# Altium schematic sheet Measurment ICs.SchDoc: Sensors - RC Car
size A3; DrawnBy: Grzegorz Jabłoński; Revision: V1.3; SheetNumber: 3; SheetTotal: 3
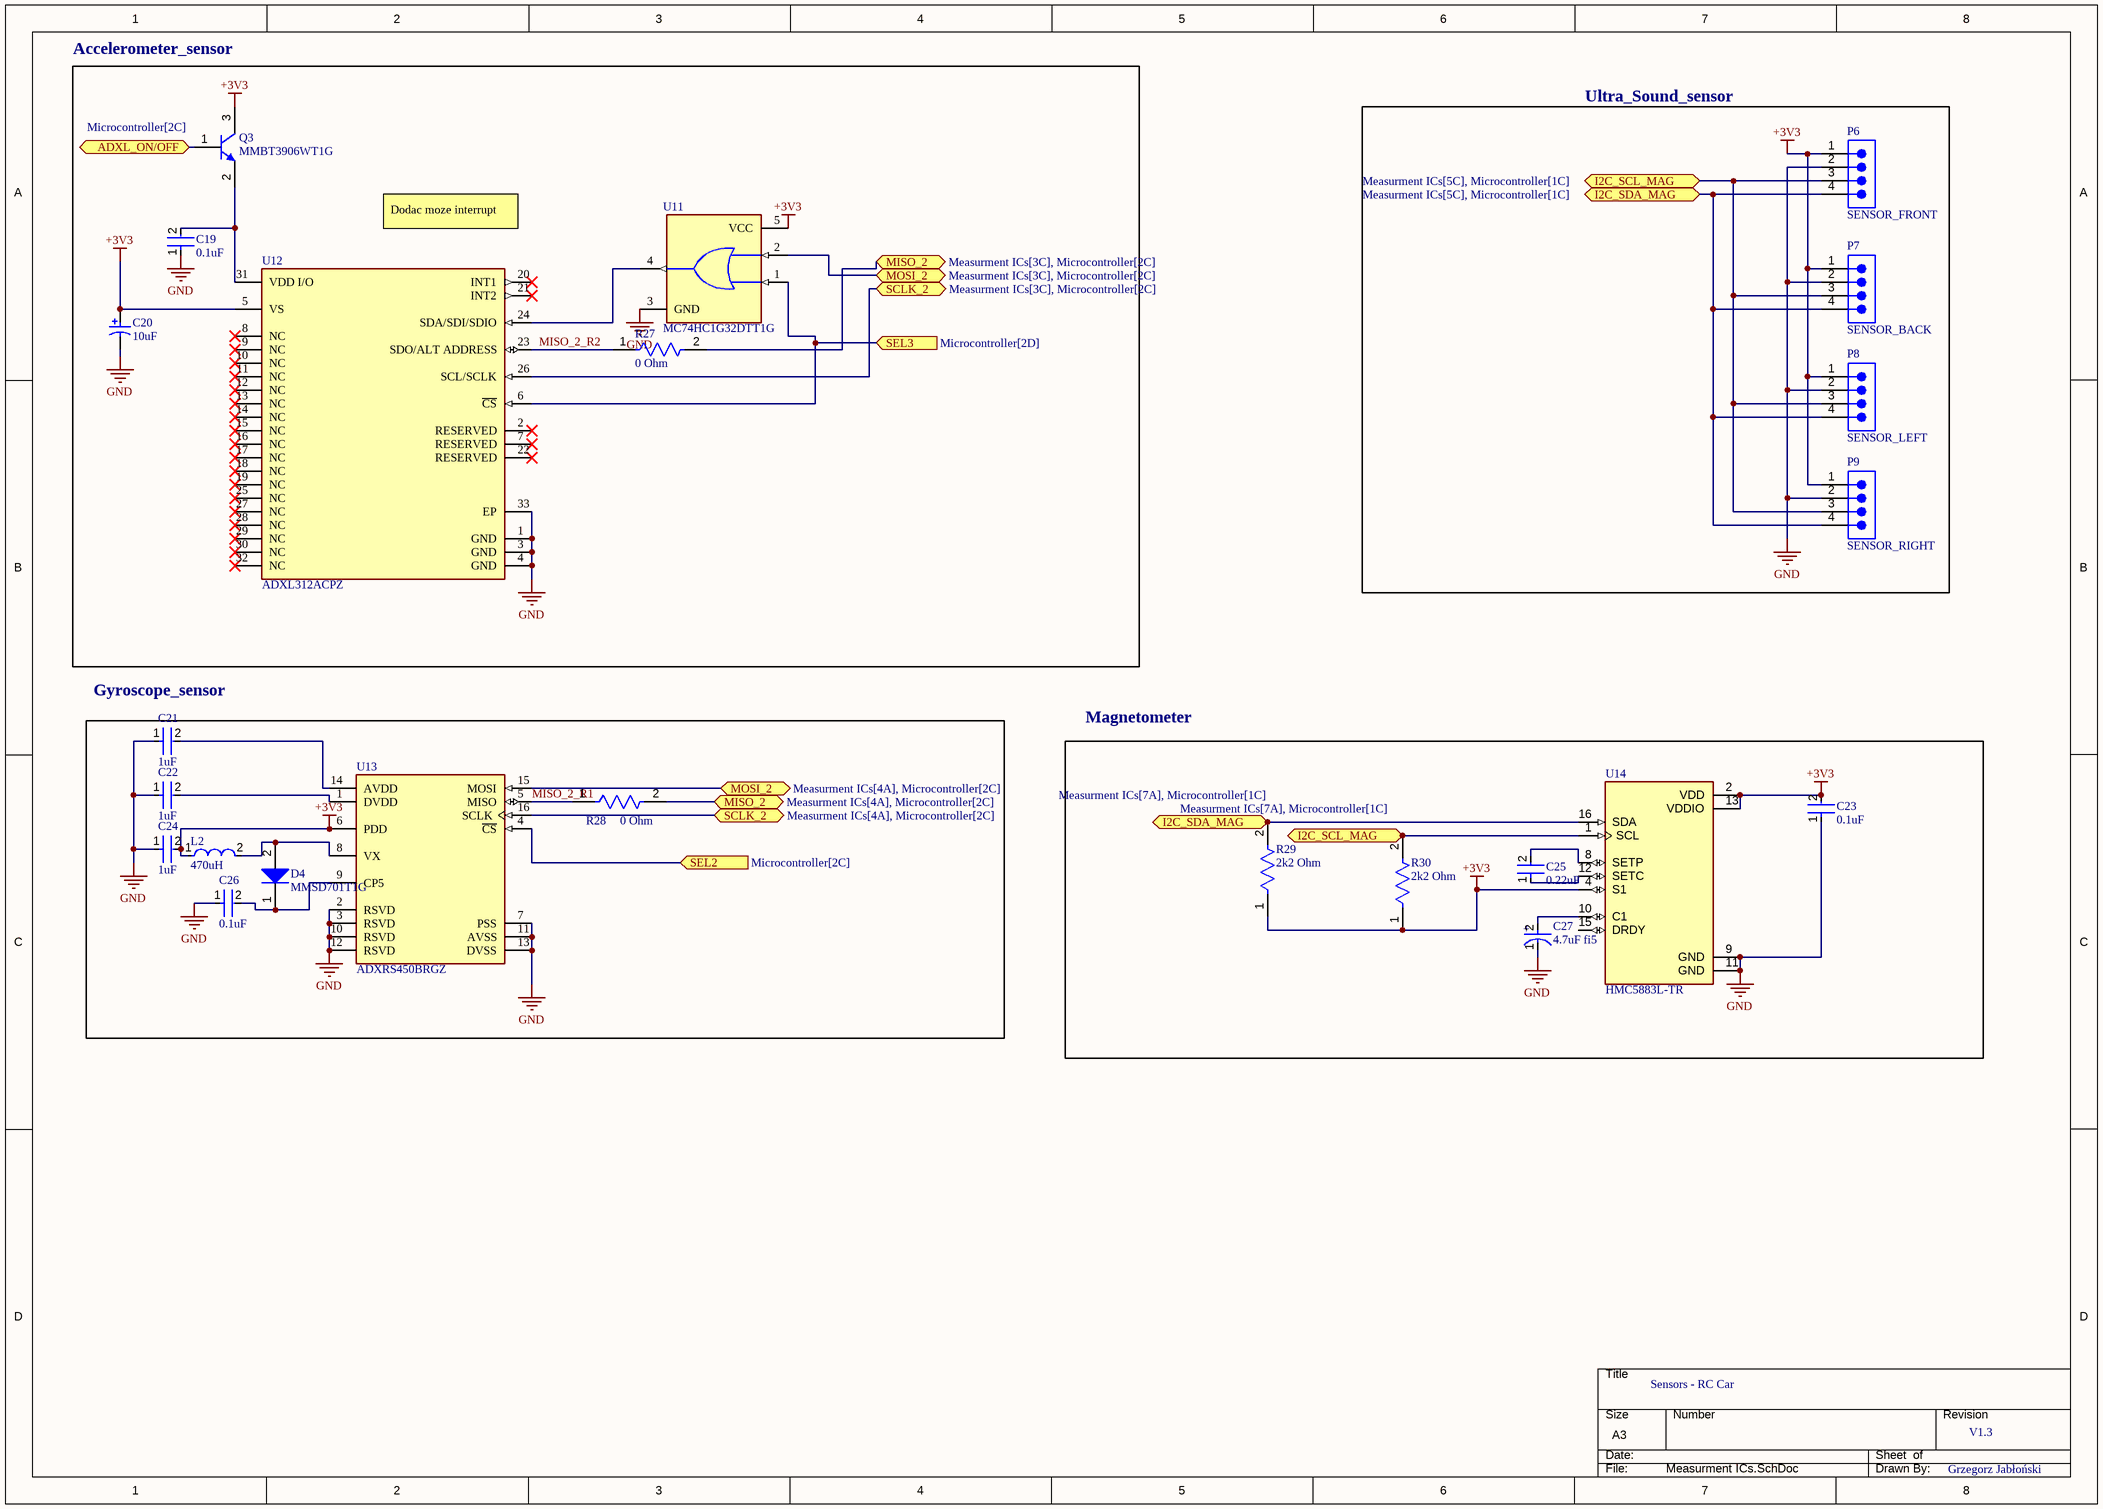
[diagram p0: Measurment ICs.SchDoc]

## Parts
C19  0.1uF  [FP-CC0805-0_85-MFG]
C20  10uF  [KEMT-A-3216-18-2_M]
C21  1uF  [FP-CC0805-0_85-MFG]
C22  1uF  [FP-CC0805-0_85-MFG]
C23  0.1uF  [FP-CC0805-0_85-MFG]
C24  1uF  [FP-CC0805-0_85-MFG]
C25  0.22uF  [FP-CC0805-0_85-MFG]
C26  0.1uF  [FP-CC0805-0_85-MFG]
C27  4.7uF fi5  [FP-RAD-TH-D_5_0_5-L_11_1-MFG]
D4  MMSD701T1G  [ONSC-SOD-123-2-425-04_V]
L2  470uH  [FP-LQH43CN_03-MFG]
P6  SENSOR_FRONT  [61300411121]
P7  SENSOR_BACK  [61300411121]
P8  SENSOR_LEFT  [61300411121]
P9  SENSOR_RIGHT  [61300411121]
Q3  MMBT3906WT1G  [ONSC-SC-70-3-419-04_V]
R27  0 Ohm  [FP-RMCF0805-MFG]
R28  0 Ohm  [FP-RMCF0805-MFG]
R29  2k2 Ohm  [FP-RMCF0805-MFG]
R30  2k2 Ohm  [FP-RMCF0805-MFG]
U11  MC74HC1G32DTT1G  [FP-483-MFG]
U12  ADXL312ACPZ  [FP-CP-32-17-MFG]
U13  ADXRS450BRGZ  [FP-RG-16-1-IPC_C]
U14  HMC5883L-TR  [XDCR_HMC5883L-TR]

## Blocks framed on the sheet
Ultra_Sound_sensor: P6-P9
Magnetometer: C23 C25 C27 R29 R30 U14

## Ports
ADXL_ON/OFF (bidir, see Microcontroller[2C]), I2C_SCL_MAG (bidir, see Measurment ICs[5C], Microcontroller[1C]), I2C_SCL_MAG (bidir, see Measurment ICs[7A], Microcontroller[1C]), I2C_SDA_MAG (bidir, see Measurment ICs[5C], Microcontroller[1C]), I2C_SDA_MAG (bidir, see Measurment ICs[7A], Microcontroller[1C]), MISO_2 (bidir, see Measurment ICs[3C], Microcontroller[2C]), MISO_2 (bidir, see Measurment ICs[4A], Microcontroller[2C]), MOSI_2 (bidir, see Measurment ICs[3C], Microcontroller[2C]), MOSI_2 (bidir, see Measurment ICs[4A], Microcontroller[2C]), SCLK_2 (bidir, see Measurment ICs[3C], Microcontroller[2C]), SCLK_2 (bidir, see Measurment ICs[4A], Microcontroller[2C]), SEL2 (in, see Microcontroller[2C]), SEL3 (in, see Microcontroller[2D])

## Nets
+3V3: C20.1 C23.2 C24.2 L2.1 P6.1 P7.1 P8.1 P9.1 Q3.3(C) R29.1 R30.1 U11.5(VCC) U12.5(VS) U13.6(PDD) U14.2(VDD) U14.4(S1) U14.13(VDDIO)
GND: C19.1 C20.2 C21.1 C22.1 C23.1 C24.1 C26.1 C27.1(C) P6.2 P7.2 P8.2 P9.2 U11.3(GND) U12.1(GND) U12.3(GND) U12.4(GND) U12.33(EP) U13.2(RSVD) U13.3(RSVD) U13.7(PSS) U13.10(RSVD) U13.11(AVSS) U13.12(RSVD) U13.13(DVSS) U14.9(GND) U14.11(GND)
ADXL_ON/OFF: Q3.1(B) ; port ADXL_ON/OFF
I2C_SCL_MAG: P6.3 P7.3 P8.3 P9.3 R30.2 U14.1(SCL) ; port I2C_SCL_MAG
I2C_SDA_MAG: P6.4 P7.4 P8.4 P9.4 R29.2 U14.16(SDA) ; port I2C_SDA_MAG
MISO_2: R27.2 R28.2 ; port MISO_2
MISO_2_R1: R28.1 U13.5(MISO)
MISO_2_R2: R27.1 U12.23(SDO/ALT_ADDRESS)
MOSI_2: U11.2(A) U13.15(MOSI) ; port MOSI_2
SCLK_2: U12.26(SCL/SCLK) U13.16(SCLK) ; port SCLK_2
SEL2: U13.4(~{CS}) ; port SEL2
SEL3: U11.1(B) U12.6(~{CS}) ; port SEL3
NetC19_2: C19.2 Q3.2(E) U12.31(VDD_I/O)
NetC21_2: C21.2 U13.14(AVDD)
NetC22_2: C22.2 U13.1(DVDD)
NetC25_1: C25.1 U14.12(SETC)
NetC25_2: C25.2 U14.8(SETP)
NetC26_2: C26.2 D4.1(K) U13.9(CP5)
NetC27_2: C27.2(A) U14.10(C1)
NetD4_2: D4.2(A) L2.2 U13.8(VX)
NetU11_4: U11.4(Y) U12.24(SDA/SDI/SDIO)

Not connected (* = marked no-connect by the designer): U12 2(RESERVED)* 7(RESERVED)* 8(NC)* 9(NC)* 10(NC)* 11(NC)* 12(NC)* 13(NC)* 14(NC)* 15(NC)* 16(NC)* 17(NC)* 18(NC)* 19(NC)* 20(INT1)* 21(INT2)* 22(RESERVED)* 25(NC)* 27(NC)* 28(NC)* 29(NC)* 30(NC)* 32(NC)*; U14 15(DRDY)

## Notes on the sheet
- Accelerometer_sensor
- Dodac moze interrupt
- (near C21) Gyroscope_sensor
- THIS DOCUMENT AND THE DATA DISCLOSED HEREIN OR
- HEREWITH IS THE PROPERTY OF ALTIUM LIMITED AND MAY
- DWG NO:
- REVISION
- REV:
- DESCRIPTION
- DATE
- APPROVED
- BE FREELY DISTRIBUTED IN WHOLE. NO RIGHTS ARE
- RESERVED OR EXPRESS OR IMPLIED WARANTEE GIVEN.
- ENG:
- APPROVALS
- PROJECT
- DSN:
- CHK:
- REFERENCE DOCUMENTS
- PROJECT REVISION:
- TITLE
- DOCUMENT REVISION:
- DESIGN ITEM:
- BOM:
- FAB DWG:
- PCB DWG:
- ASSY DWG:
- SCALE:
- A3
- SIZE
- CAGE CODE
- FILE NAME
- DWG NO.
- SHEET
- OF
- REV
- (in symbol CMP-05427-001989-1) +

## Library data of the parts
C19 C21-C26 = CMP-2100-03606-3: CAP CER 0.1UF 50V X7R 0805; Manufacturer Part Number: CC0805KRX7R9BB104; Manufacturer: Yageo; Tolerance: 0.1; Capacitance: 100 nF; Value: 100 nF; Material: Ceramic; Device Class L1: Passive Components; ComponentLink2Description: Datasheet; Package: CC0805-0.85; Digikey Description: CAP CER 0.1UF 50V X7R 0805; Device Class L3: Ceramic Capacitors; Temperature: -30°C to +85°C; Temperature Characteristic: X7R; Voltage Rating: 50 V; Height: 0.95mm; RoHS: TRUE; Ipc Land Pattern Name: CAPC200125X85; Device Class L2: Capacitors; Category: Cap; Temperature Range Low: -30°C; Temperature Range High: +85°C; Mouser Description: Multilayer Ceramic Capacitors MLCC - SMD/SMT 100nF 50V X7R 10%; Footprint Url: http://www.yageo.com/exep/pages/download/literatures/UPY-C_GEN_24.pdf; Automotive: No; Octopart: https://octopart.com/cc0805krx7r9bb104-yageo-192993; Lead Free: Yes; ComponentLink2URL: http://www.yageo.com/documents/recent/UPY-GPHC_Y5V_6.3V-to-50V_8.pdf
C20 = CMP-2000-05172-1: Capacitor, Tantalum, 10 uF, +/- 10%, 10 V, -55 to 125 degC, 2-Pin SMD (1206), RoHS, Tape and Reel; Manufacturer Size Code: A; Manufacturer: Kemet; Type: Molded; Online Catalog: T491Series; Other Names: 399-3684-2; Voltage - Rated: 10V; Lifetime @ Temp.: 2000Hrs@85degC; Product Training Modules: CapacitorBasics-TypicalUsesforCapacitorsDeratingGuidelinesforSurfaceMountTantalumCapacitors; ESR (Equivalent Series Resistance): 3.8Ohm; Capacitance: 10µF; Catalog Drawings: T49x,T5xxSeries_A-side1T49x,T5xxSeries_A,B-side2T49x,T5xxSeries_A,SBottom; Family: TantalumCapacitors; Manufacturer URL: http://www.kemet.com/; Datasheet URL: http://www.farnell.com/datasheets/1824869.pdf; Package Reference: 1206; Packaging: Tape&Reel(TR); Series: T491; Operating Temperature: -55degC~125degC; Mounting Type: SurfaceMount; Height - Seated (Max): 0.071"(1.80mm); Package / Case: 1206(3216Metric); Package Description: 2-Pin Surface Mount Device, Body 3.2 x 1.6 mm; Features: GeneralPurpose; Tolerance: ±10%; Lead Spacing: -; Size / Dimension: 0.126"Lx0.063"W(3.20mmx1.60mm); Standard Package: 2,000; Datasheet Version: Apr-14; Category: Capacitors
C27 = CMP-05427-001989-1: Aluminum Electrolytic Capacitors (Radial Lead Type) AEC-Q200 Qualified 22uF ±20% 50V; Ripple Current: 155mA; Polarity: Polar; ESR (Equivalent Series Resistance): 1.3R; Life (Hours): 1000Hour; Leakage Current: 3uA; Lead Diameter: 0.5mm; Termination: Radial; Radiation Hardening: No; RoHS Compliant: Yes; Case/Package: Radial; Height: 11mm; Package Quantity: 2000; Min Operating Temperature: -55°C; Length: 11mm; Contact Plating: Tin; Series: FC; Voltage Rating: 50V; Diameter: 5mm; Capacitance: 22uF; Features: General Purpose; Max Operating Temperature: 105°C; Tolerance: 20%; Voltage Rating (DC): 50V; Mount: Through Hole; Impedance: 1.3R; Lead Pitch: 0.197inch; Packaging: Tape and Reel; Height - Seated (Max): 0.472inch
D4 = CMP-1055-00417-1: Schottky Barrier Diode, 2-Pin SOD-123, Pb-Free, Tape and Reel; Manufacturer: On Semiconductor; Configuration: Single; Packing: Tape and Reel; PackageDescription: 2-Pin SOD, Body 1.6 x 2.69 mm; DatasheetVersion: Rev. 6; ComponentLink1URL: http://www.onsemi.com/; PackageReference: SOD-123-2-425-04; ComponentLink2Description: Datasheet; ComponentLink2URL: http://www.onsemi.cn/pub_link/Collateral/MMSD301T1-D.PDF; ComponentLink1Description: Manufacturer URL; PackageVersion: Rev. G, 10/2009; Mounting Technology: Surface Mount; PartNumber: MMSD701T1G; ComponentLink3URL: http://www.onsemi.com/pub_link/Collateral/425-04.PDF; ComponentLink3Description: Package Specification; RoHS: TRUE
L2 = CMP-06042-007054-1: Wire Wound Ferrite Inductor for General Circuits 470μH ±10% 11.8Ω 80mA 1812; Q Factor: 40; Self Resonant Frequency: 3MHz; Shielding: Unshielded; Test Frequency: 1kHz; Series Resistance: 11.8R; Core Material: Ferrite; Tolerance: 10%; Weight: 0.004586oz; Width: 3.2mm; Case/Package: 1812; Military Standard: Not; Resistor Type: Wirewound; Max Operating Temperature: 85°C; Lead Free: Lead Free; Packaging: Tape and Reel; Inductance: 470uH; Termination: SMD/SMT; Case Code (Imperial): 1812; Length: 4.5mm; Height - Seated (Max): 0.11inch; Height: 2.6mm; Min Operating Temperature: -40°C; Max DC Current: 80mA; Radiation Hardening: No; Frequency: 3MHz; Package Quantity: 500; Mount: Surface Mount; Case Code (Metric): 4532; DC Current: 80mA; DC Resistance (DCR): 11.8R; Current Rating: 80mA; Depth: 3.4mm
P6-P9 = CMP-1502-01064-3: NexarPartId: 32855522; Operating Supply Voltage: 250V; Pitch: 2.54mm; Contact Resistance: 20mΩ; Number of Positions: 4; Current Rating: 3A; Connector Type: Male Pin; Gender: Male; Contact Plating: Gold; Height: 8.89mm; Lead Pitch: 2.54mm; Lead Free: Lead Free; Contact Mating Length: 5.9944mm; Number of Rows: 1; Termination: Solder; Packaging: Bulk; REACH SVHC: Unknown; Min Operating Temperature: -40°C; RoHS: Compliant; Number of Contacts: 4; Voltage Rating: 250V; Color: Black; Max Operating Temperature: 105°C; Contact Material: Copper; Mount: Through Hole; Orientation: Vertical; Number of Pins: 4
Q3 = CMP-1048-00381-1: General Purpose Transistor, PNP Silicon, 3-Pin SC70, Pb-Free, Tape and Reel; Manufacturer: On Semiconductor; IC Continuous (A): -0.2; fT Min (MHz): 250; PackageDescription: 3-Pin Small Outline Transistor, Body 2 x 1.25 mm, Pitch 0.65 mm; PartNumber: MMBT3906WT1G; ComponentLink2Description: Datasheet; Packing: Tape and Reel; Mounting Technology: Surface Mount; ComponentLink3Description: Package Specification; DatasheetVersion: Rev. 8; ComponentLink2URL: http://www.onsemi.cn/pub_link/Collateral/MMBT3904WT1-D.PDF; Polarity: PNP; ComponentLink3URL: http://www.onsemi.cn/pub_link/Collateral/419-04.PDF; ComponentLink1Description: Manufacturer URL; PackageReference: SC-70-3-419-04; ComponentLink1URL: http://www.onsemi.com/; RoHS: TRUE; PackageVersion: Rev. N, 11/2008
R27-R30 = CMP-26527-000017-1: RES 0 OHM JUMPER 1/8W 0805; Power Rating: 125mW; Resistance: 0mR; Depth: 1.25mm; Length: 2mm; Military Standard: Not; Width: 0.049inch; Case Code (Imperial): 0805; Number of Terminations: 2; Mount: Surface Mount; Contact Plating: Tin; Height: 0.026inch; Case/Package: 0805; Min Operating Temperature: -55°C; Composition: Thick Film; Max Operating Temperature: 155°C; Packaging: Tape and Reel; Features: Automotive AEC-Q200; Max Power Dissipation: 125mW; Radiation Hardening: No; Lead Free: Lead Free; Case Code (Metric): 2012
U11 = CMP-00278-00467123-1: MC74HC1G32DTT1G MC74HC Series 4 V Surface Mount Single 2-Input OR Gate - TSOP-5; NexarPartId: 467123; Manufacturer Lifecycle Status: ACTIVE; Low Level Output Current: 2.6mA; Schmitt Trigger Input: No; Propagation Delay: 7ns; High Level Output Current: -2.6mA; Number of Elements: 1; Number of Inputs: 2; Turn-On Delay Time: 100ns; Min Supply Voltage: 2V; Quiescent Current: 1µA; Max Junction Temperature (Tj): 150°C; Operating Supply Voltage: 4V; Max Supply Voltage: 6V; Min Operating Temperature: -55°C; Output Current: 2.6mA; Number of Pins: 5; Contact Plating: Tin; Case/Package: TSOP; Max Operating Temperature: 125°C; RoHS: Compliant; Number of Circuits: 1; Lifecycle Status: Production; Packaging: Tape & Reel (TR); Width: 1.5mm; Radiation Hardening: No; Number of Gates: 1; Ambient Temperature Range High: 125°C; Lead Free: Lead Free; Schedule B: 8542390000, 8542390000; Number of Outputs: 1; Number of Channels: 1; REACH SVHC: No SVHC; Mount: Surface Mount; Logic Function: OR; Halogen Free: Halogen Free; Height: 1mm; Length: 3mm
U12 = CMP-0885-00061-2: ACCEL 1.5-12G I2C/SPI 32LFCSP; Supply Current: 170uA; Interface: I2C; Sensitivity: 345LSB/g; Output Type: Digital; Axis: X, Y, Z; Min Supply Voltage: 2V; Bandwidth: 3.125Hz; -3db Bandwidth: 1.6kHz; Max Supply Voltage: 3.6V; Packaging: Rail/Tube; REACH SVHC: No SVHC; Operating Supply Current: 170uA; Radiation Hardening: No; Nominal Supply Current: 170uA; Case/Package: LFCSP EP; Series: -; Lead Free: Contains Lead; Length: 5mm; Max Operating Temperature: 105°C; Number of Pins: 32; Depth: 5mm; Contact Plating: Tin; Package Quantity: 60; RoHS Compliant: Yes; Min Operating Temperature: -40°C; Height: 1.5mm; Width: 5.1mm
U13 = CMP-09161-000004-1: SENS GYRO 300DEG/S DGTL 16SOIC; Bandwidth: 80Hz; Output Type: SPI; Max Supply Voltage: 5.25V; Resolution: 16b; Operating Supply Current: 6mA; Min Supply Voltage: 3.15V; Axis: Z; Linearity: 99.75%; Packaging: Rail/Tube; Max Operating Temperature: 105°C; Width: 7.8mm; Min Operating Temperature: -40°C; Series: -; RoHS Compliant: Yes; Lead Free: Contains Lead; Mount: Surface Mount; Package Quantity: 1; Supply Current: 6mA; Interface: SPI; Length: 10.3mm; -3db Bandwidth: 80Hz; Case/Package: SOIC; Height: 3.73mm; Nominal Supply Current: 6mA; REACH SVHC: No SVHC; Number of Pins: 16
U14 = HMC5883L-TR: Board Mount Hall Effect / Magnetic Sensors Sensors, Transducers Magnetic - Hall Effect, Digital Switch, Linear, Compass (ICs) - IC COMPASS 3 AXIS I2C 16LCC SMD; MF: STMicroelectronics; MP: HMC5883LTR; Price: None; SnapEDA_Link: https://www.snapeda.com/parts/HMC5883LTR/STMicroelectronics/view-part/?ref=snap; Check_prices: https://www.snapeda.com/parts/HMC5883LTR/STMicroelectronics/view-part/?ref=eda; Package: LCC-16 STMicroelectronics; Availability: Not in stock; Value: *